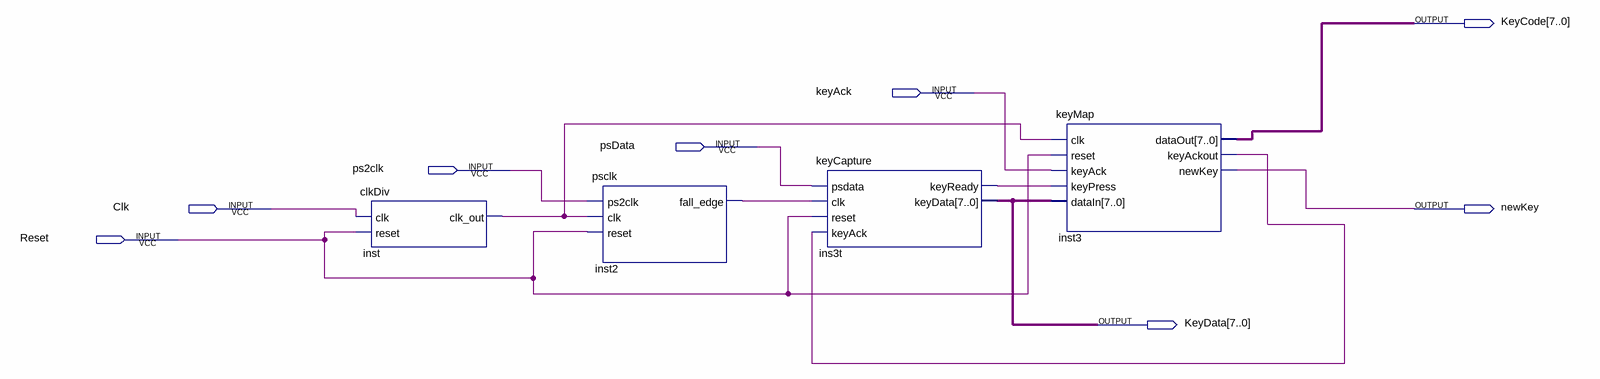
[diagram p0: schematic sheet]
// Quartus schematic keyboard.bdf as structural Verilog: 4 symbols, 8 pins
module keyboard (
  input  keyAck,
  input  psData,
  input  ps2clk,
  input  Clk,
  input  Reset,
  output [7:0] KeyCode,
  output newKey,
  output [7:0] KeyData
);

  wire ins3t_keyready, inst2_fall_edge, inst3_keyackout, inst_clk_out;

  clkDiv inst (.clk(Clk), .reset(Reset), .clk_out(inst_clk_out));
  psclk inst2 (.ps2clk(ps2clk), .clk(inst_clk_out), .reset(Reset), .fall_edge(inst2_fall_edge));
  keyCapture ins3t (
    .psdata(psData), .clk(inst2_fall_edge), .reset(Reset), .keyAck(inst3_keyackout),
    .keyReady(ins3t_keyready), .keyData(KeyData));
  keyMap inst3 (
    .clk(inst_clk_out), .reset(Reset), .keyAck(keyAck), .keyPress(ins3t_keyready), .dataIn(KeyData),
    .dataOut(KeyCode), .keyAckout(inst3_keyackout), .newKey(newKey));
endmodule
